# Altium schematic sheet Sheet1.SchDoc
size 420 x 297 mm; Address1: Address1; Address2: Address2; Address3: Address3; Address4: Address4; SheetNumber: 1; Scale: 1:1; Разраб.: Лепотенко; Обозначение документа: ЛАС.42554622.001Э3; Перв. применение: ЛАС.42554622.001; Наименование изделия 1: Термометр; Наименование изделия 2: Схема электрическая; Наименование изделия 3: принципиальная; Нач. отд.: Нач. отд.
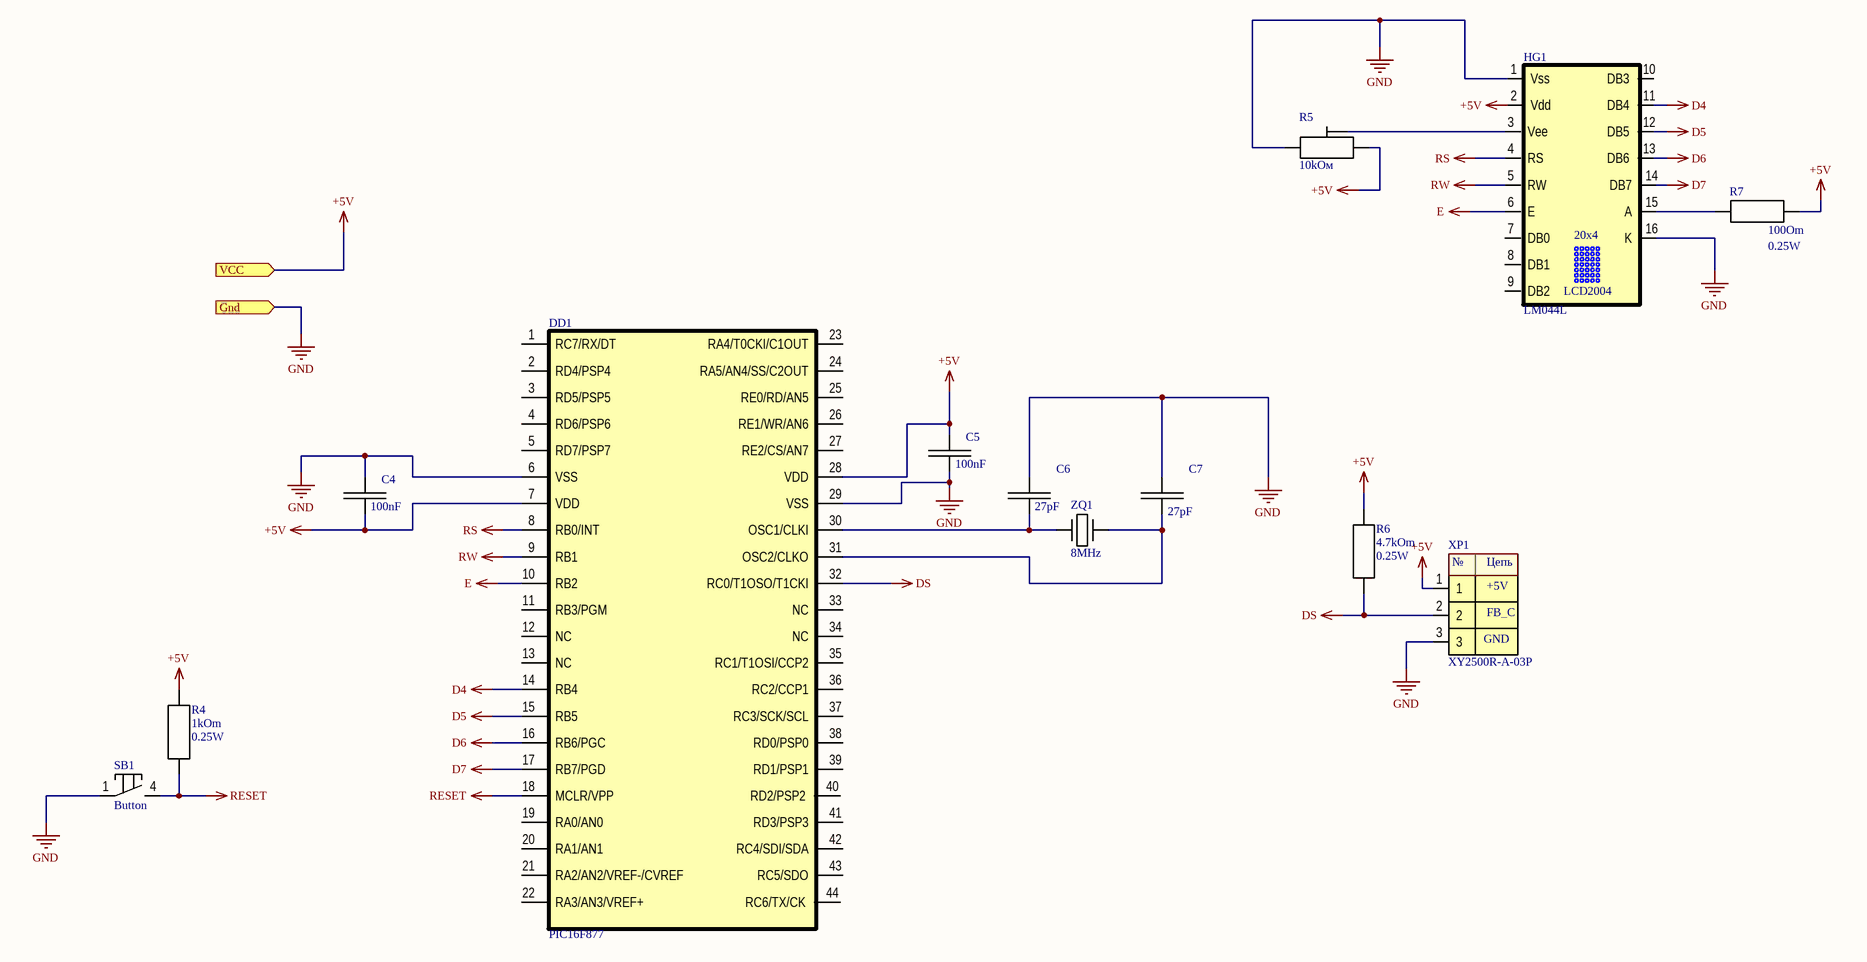
[diagram p0: Sheet1.SchDoc]

## Parts
C4  100nF  [CAP1206]
C5  100nF  [CAP1206]
C6  27pF  [CAP1206]
C7  27pF  [CAP1206]
DD1  PIC16F877  [TQFP80P1200X1200X120-44N]
HG1  LM044L  [LCD2004]
R4  value 1kOm  Power: 0.25W  [1206]  (hidden comment: Resistor)
R5  10kОм  [3006P]
R6  Power: 0.25W  [1206]  (hidden comment: 4.7kOm)
R7  Power: 0.25W  [1206]  (hidden comment: 100Om)
SB1  Button  [KLS2]
XP1  XY2500R-A-03P  [XY2500R-A-03P]
ZQ1  8MHz  [HC-51U]

## Ports
Gnd (in), VCC (in)

## Nets
+5V: C4.2 C5.1 DD1.7(VDD) DD1.28(VDD) HG1.2(Vdd) R4.2 R5.3 R6.2 R7.1 XP1.1 ; port VCC
D4: DD1.14(RB4) HG1.11(DB4)
D5: DD1.15(RB5) HG1.12(DB5)
D6: DD1.16(RB6/PGC) HG1.13(DB6)
D7: DD1.17(RB7/PGD) HG1.14(DB7)
DS: DD1.32(RC0/T1OSO/T1CKI) R6.1 XP1.2
E: DD1.10(RB2) HG1.6(E)
GND: C4.1 C5.2 C6.1 C7.1 DD1.6(VSS) DD1.29(VSS) HG1.1(Vss) HG1.16(K) R5.1 SB1.1 XP1.3 ; port Gnd
RESET: DD1.18(MCLR/VPP) R4.1 SB1.4
RS: DD1.8(RB0/INT) HG1.4(RS)
RW: DD1.9(RB1) HG1.5(RW)
NetC6_2: C6.2 DD1.30(OSC1/CLKI) ZQ1.1
NetC7_2: C7.2 DD1.31(OSC2/CLKO) ZQ1.2
NetHG1_3: HG1.3(Vee) R5.2
NetHG1_15: HG1.15(A) R7.2

Not connected (* = marked no-connect by the designer): DD1 1(RC7/RX/DT) 2(RD4/PSP4) 3(RD5/PSP5) 4(RD6/PSP6) 5(RD7/PSP7) 11(RB3/PGM) 12(NC) 13(NC) 19(RA0/AN0) 20(RA1/AN1) 21(RA2/AN2/VREF-/CVREF) 22(RA3/AN3/VREF+) 23(RA4/T0CKI/C1OUT) 24(RA5/AN4/SS/C2OUT) 25(RE0/RD/AN5) 26(RE1/WR/AN6) 27(RE2/CS/AN7) 33(NC) 34(NC) 35(RC1/T1OSI/CCP2) 36(RC2/CCP1) 37(RC3/SCK/SCL) 38(RD0/PSP0) 39(RD1/PSP1) 40(RD2/PSP2) 41(RD3/PSP3) 42(RC4/SDI/SDA) 43(RC5/SDO) 44(RC6/TX/CK); HG1 7(DB0) 8(DB1) 9(DB2) 10(DB3)

## Notes on the sheet
- Перв. примен.
- Справ. №
- Подп. и дата
- Инв. № дубл.
- Взам. инв. №
- Разраб.
- Изм.
- Лист
- № докум.
- Подп.
- Дата
- Лит.
- Масса
- Масштаб
- Пров.
- Т.контр.
- Листов
- Инв. № подл.
- Утв.
- Н.контр.
- Копировал
- Формат А3
- (in symbol LM044L) 20x4; LCD2004
- (in symbol XY2500R-A-03P) №; Цепь; +5V; FB_C; GND

## Library data of the parts
C4 C5 = Capasitor: Part Number: CL31B104KCFNNNE; Manufacturer: Samsung; Voltage: 100V; Value: 100nF; Quantity: 3; Package: 1206; Price: 0.205; ShoppingPlace: http://belchip.by/product/?selected_product=30380
C6 = Capasitor: Part Number: LFL106270NPO; Manufacturer: FAITHFULL LINK; Voltage: 50V; Value: 27pF; Quantity: 10; Package: 1206; Price: 0.025; ShoppingPlace: http://belchip.by/product/?selected_product=00261
C7 = Capasitor: Part Number: FL1206270NPO; Manufacturer: FAITHFULL LINK; Voltage: 50V; Value: 27pF; Quantity: 10; Package: 1206; Price: 0.025; ShoppingPlace: http://belchip.by/product/?selected_product=00261
DD1 = PIC16F877: Part Number: PIC16F877A; Manufacturer: Micchip; Price: 2.76; ShoppingPlace: https://ru.aliexpress.com/item/Free-Shipping-5pcs-lot-PIC16F877A-PIC16F877A-I-PT-Microcontrollers-SMD-TQFP-44-new-original/32589109618.html?s=p&ws_ab_test=searchweb0_0,searchweb201602_2_10152_10151_10065_10344_10068_5722815_10342_10343_10340_5722915_10341_5722615_10697_10696_10084_10083_10618_10307_5722715_10059_10534_308_100031_10103_441_10624_10623_10622_5722515_10621_10620,searchweb201603_1,ppcSwitch_5&algo_expid=19ea4dca-365d-404e-8202-e740e16aa93f-5&algo_pvid=19ea4dca-365d-404e-8202-e740e16aa93f&transAbTest=ae803_2&priceBeautifyAB=0; Package: TQFP-44; Quantity: 1
HG1 = LM044L: Part Number: LM044L-HD44780U; Manufacturer: HITACHI; Package: 16x2.54; ShoppingPlace: https://ru.aliexpress.com/item/LCD-Module-Display-2004-204-HD44780-Yellow-Green-Blacklight-FOR-ARDUINO/32627610997.html?ws_ab_test=searchweb0_0,searchweb201602_2_10152_10151_10065_10344_10068_5722815_10342_10343_10340_5722915_10341_5722615_10697_10696_10084_10083_10618_10307_5722715_10059_10534_308_100031_10103_441_10624_10623_10622_5722515_10621_10620,searchweb201603_1,ppcSwitch_5&algo_expid=81ba670d-1ac6-4fbd-8476-00369042280d-42&algo_pvid=81ba670d-1ac6-4fbd-8476-00369042280d&transAbTest=ae803_2&priceBeautifyAB=0; Quantity: 1; Price: 6.36
R4 R6 = Resistor: Manufacturer: Royal Ohm; Part Number: SMD1206-1K; Quntity: 4; Price: 0.15; Package: 1206
  R4: ShoppingPlace: http://belchip.by/product/?selected_product=01384
  R6: ShoppingPlace: http://belchip.by/product/?selected_product=01399; Value: 4.7kOm
R5 = POT: Part Number: 3006-103-Z-LF; Manufacturer: Bours; Power: 0,125W; Package: 3006; Price: 0,445; ShoppingPlace: http://belchip.by/product/?selected_product=32831; Value: 10kОм; Quantity: 1
R7 = Resistor: Manufacturer: YAGEO; Part Number: RC1206FR-07100RL; Quntity: 4; Price: 0.15; Package: 1206; ShoppingPlace: http://belchip.by/product/?selected_product=18520; Value: 100Om
XP1 = XY2500R-A-03P: Manufacturer: RUICHI; Value: 1000V; Part Number: XY2500R-A-03P; Quantity: 1; Price: 0.12; Package: XY2500R-A-03P; ShoppingPlace: http://belchip.by/product/?selected_product=31794
ZQ1 = Rzanator: Part Number: HC-51; Manufacturer: CHina; Value: 8MHz; Package: HC-51; Quantity: 1; Price: 0.255; ShoppingPlace: http://belchip.by/product/?selected_product=33253
SB1 = Button: Part Number: *; Price: *; Value: *; ShoppingPlace: *; Quantity: *; Package: *; Manufacturer: *